# Altium schematic sheet BMS High-Side FET Driver.SchDoc
size A3
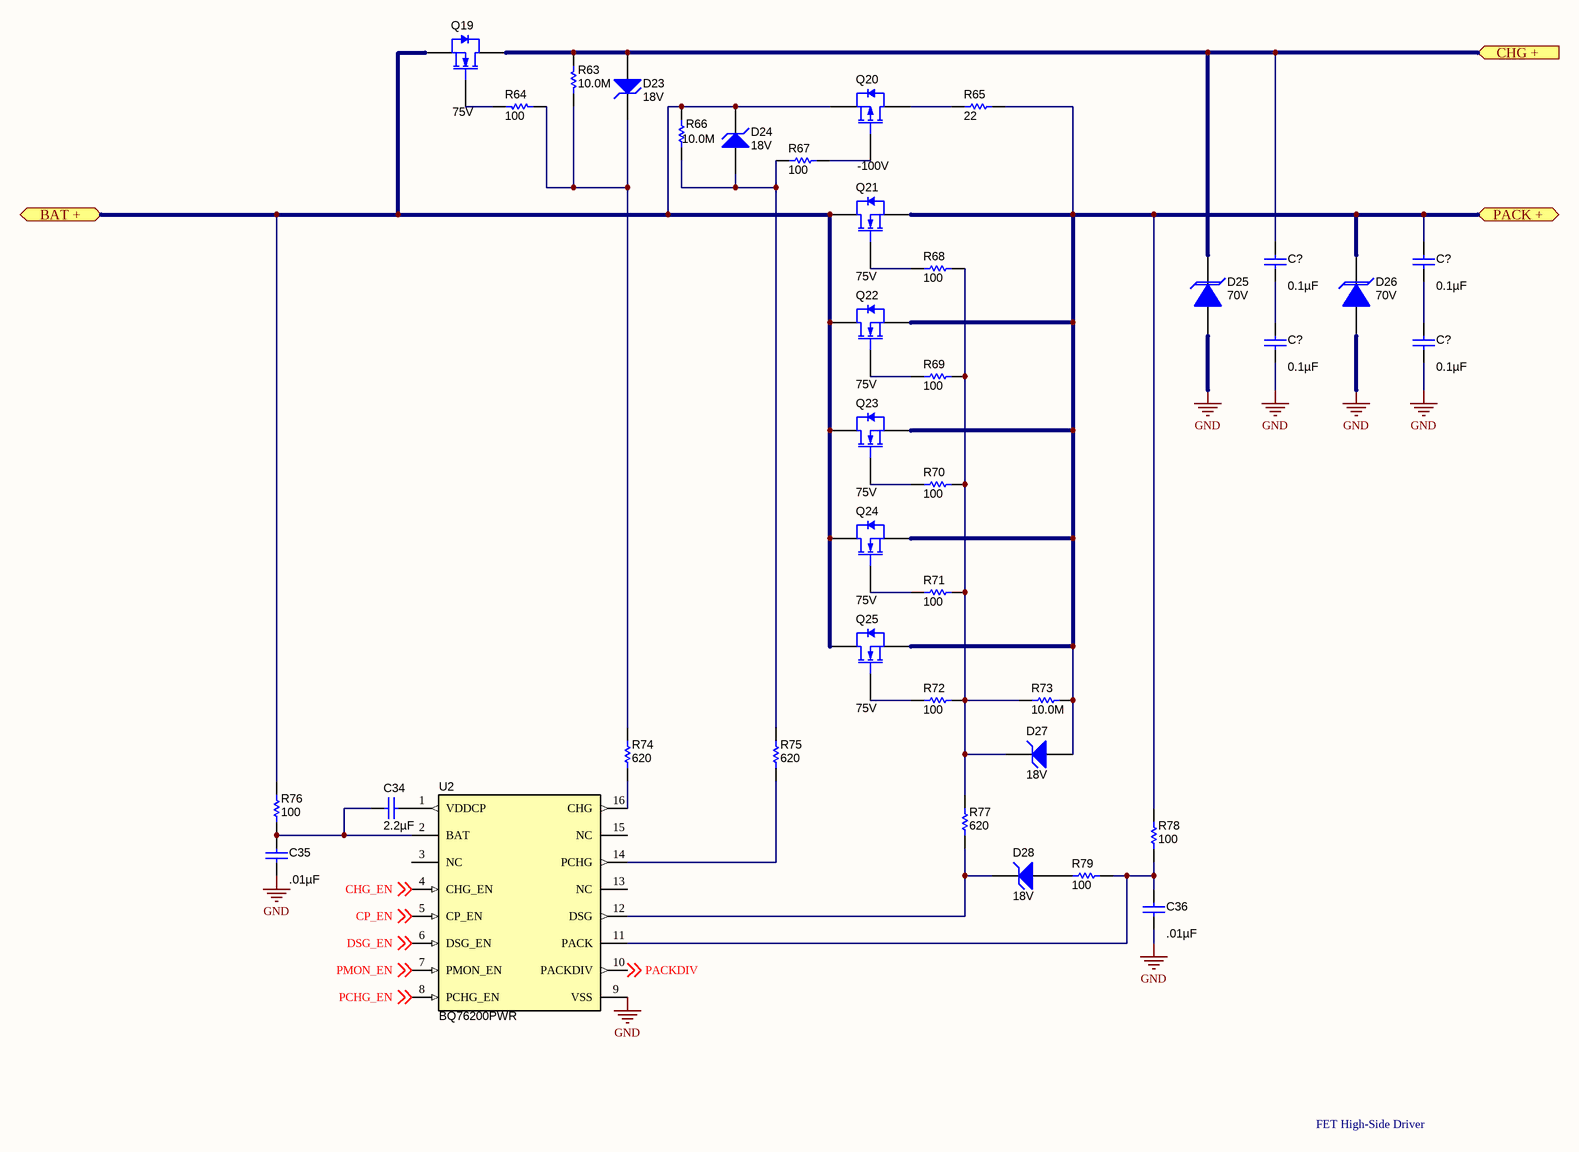
[diagram p0: BMS High-Side FET Driver.SchDoc]

## Parts
(Parts that share a designator on the sheet are numbered #1, #2 ... from top to bottom, then left to right.)
C34  ValueDisplayed: 2.2µF  [CAP 0805/2012]  (hidden comment: CGA4J1X7R1V225K125AE)
C35  ValueDisplayed: .01µF  [CAP 0805/2012]  (hidden comment: GCM188R72A103KA37D)
C36  ValueDisplayed: .01µF  [CAP 0805/2012]  (hidden comment: GCM188R72A103KA37D)
C?#1  ValueDisplayed: 0.1µF  [CAP 0603/1608]  (hidden comment: CL10B104KC8NNNC)
C?#2  ValueDisplayed: 0.1µF  [CAP 0603/1608]  (hidden comment: CL10B104KC8NNNC)
C?#3  ValueDisplayed: 0.1µF  [CAP 0603/1608]  (hidden comment: CL10B104KC8NNNC)
C?#4  ValueDisplayed: 0.1µF  [CAP 0603/1608]  (hidden comment: CL10B104KC8NNNC)
D23  value 18V  [SOD-123]  (hidden comment: BZT52C18-E3-08)
D24  value 18V  [SOD-123]  (hidden comment: BZT52C18-E3-08)
D25  value 70V  [DO214AC SMA]  (hidden comment: SMAT70A-13-F)
D26  value 70V  [DO214AC SMA]  (hidden comment: SMAT70A-13-F)
D27  value 18V  [SOD-123]  (hidden comment: BZT52C18-E3-08)
D28  value 18V  [SOD-123]  (hidden comment: BZT52C18-E3-08)
Q19  value 75V  [DIRECTFET L8]  (hidden comment: IRF7759L2)
Q20  value -100V  [D-PAK]  (hidden comment: IRFR5410TRPBF)
Q21  value 75V  [DIRECTFET L8]  (hidden comment: IRF7759L2)
Q22  value 75V  [DIRECTFET L8]  (hidden comment: IRF7759L2)
Q23  value 75V  [DIRECTFET L8]  (hidden comment: IRF7759L2)
Q24  value 75V  [DIRECTFET L8]  (hidden comment: IRF7759L2)
Q25  value 75V  [DIRECTFET L8]  (hidden comment: IRF7759L2)
R63  ValueDisplayed: 10.0M  [RES 0603/1608]  (hidden comment: RCS060310M0FKEA)
R64  value 100  [RES 0603/1608]  (hidden comment: ERJ-PA3J101V)
R65  ValueDisplayed: 22  [STACKPOLE CSR2512]  (hidden comment: 352222RJT)
R66  ValueDisplayed: 10.0M  [RES 0603/1608]  (hidden comment: RCS060310M0FKEA)
R67  value 100  [RES 0603/1608]  (hidden comment: ERJ-PA3J101V)
R68  value 100  [RES 0603/1608]  (hidden comment: ERJ-PA3J101V)
R69  value 100  [RES 0603/1608]  (hidden comment: ERJ-PA3J101V)
R70  value 100  [RES 0603/1608]  (hidden comment: ERJ-PA3J101V)
R71  value 100  [RES 0603/1608]  (hidden comment: ERJ-PA3J101V)
R72  value 100  [RES 0603/1608]  (hidden comment: ERJ-PA3J101V)
R73  ValueDisplayed: 10.0M  [RES 0603/1608]  (hidden comment: RCS060310M0FKEA)
R74  ValueDisplayed: 620  [RES 0603/1608]  (hidden comment: ERJ-3EKF6200V)
R75  ValueDisplayed: 620  [RES 0603/1608]  (hidden comment: ERJ-3EKF6200V)
R76  value 100  [RES 0603/1608]  (hidden comment: ERJ-PA3J101V)
R77  ValueDisplayed: 620  [RES 0603/1608]  (hidden comment: ERJ-3EKF6200V)
R78  value 100  [RES 0603/1608]  (hidden comment: ERJ-PA3J101V)
R79  value 100  [RES 0603/1608]  (hidden comment: ERJ-PA3J101V)
U2  BQ76200PWR  [TTSOP16_N V2]

## Ports
BAT + (bidir), CHG + (in), PACK + (bidir)

## Nets
GND: C35.2 C36.2 C?#3.2 C?#4.2 D25.2(A) D26.2(A) U2.9(VSS)
BAT +: D24.1(K) Q19.2(S) Q20.2(S) Q21.3(D) Q22.3(D) Q23.3(D) Q24.3(D) Q25.3(D) R66.1 R76.2 ; port BAT +
CHG +: C?#1.2 D23.2(A) D25.1(K) Q19.3(D) R63.2 ; port CHG +
CHG_EN: U2.4(CHG_EN) ; off-sheet CHG_EN
CP_EN: U2.5(CP_EN) ; off-sheet CP_EN
DSG_EN: U2.6(DSG_EN) ; off-sheet DSG_EN
PACK +: C?#2.1 D26.1(K) D27.2(A) Q21.2(S) Q22.2(S) Q23.2(S) Q24.2(S) Q25.2(S) R65.2 R73.1 R78.1 ; port PACK +
PACKDIV: U2.10(PACKDIV) ; off-sheet PACKDIV
PCHG_EN: U2.8(PCHG_EN) ; off-sheet PCHG_EN
PMON_EN: U2.7(PMON_EN) ; off-sheet PMON_EN
NetC34_1: C34.1 U2.1(VDDCP)
NetC34_2: C34.2 C35.1 R76.1 U2.2(BAT)
NetC36_1: C36.1 R78.2 R79.2 U2.11(PACK)
NetC?#1_1: C?#1.1 C?#3.1
NetC?#2_2: C?#2.2 C?#4.1
NetD23_1: D23.1(K) R63.1 R64.1 R74.2
NetD24_2: D24.2(A) R66.2 R67.1 R75.2
NetD27_1: D27.1(K) R68.2 R69.2 R70.2 R71.2 R72.1 R73.2 R77.2
NetD28_1: D28.1(K) R77.1 U2.12(DSG)
NetD28_2: D28.2(A) R79.1
NetQ19_1: Q19.1(G) R64.2
NetQ20_1: Q20.1(G) R67.2
NetQ20_3: Q20.3(D) R65.1
NetQ21_1: Q21.1(G) R68.1
NetQ22_1: Q22.1(G) R69.1
NetQ23_1: Q23.1(G) R70.1
NetQ24_1: Q24.1(G) R71.1
NetQ25_1: Q25.1(G) R72.2
NetR74_1: R74.1 U2.16(CHG)
NetR75_1: R75.1 U2.14(PCHG)

Not connected (* = marked no-connect by the designer): U2 3(NC) 13(NC) 15(NC)

## Notes on the sheet
- FET High-Side Driver

## Library data of the parts
C34 = CGA4J1X7R1V225K125AE: CAP CER 2.2µF 10% 35V X7R 0805; Manufacturer: TDK Corporation; Polarized: N; CompType: Capacitor; U/M: EA; Cap_F: 0.0000022; Tolerance_%: 10; Value1: Unknown; VDC_V: 16; TaMin_C: -55; TaMax_C: 125; Cap_Case: 0805; SizeArea_mm2: 2.5; SizeAreaWB_mm2: 4.68; SizeX_mm: 2.0; SizeY_mm: 1.25; AEC Category: Q200; SymbolVersion: 2008-07-09; Value: 2.2µF; PartNumber: CGA4J1X7R1V225K125AE; PackageReference: 0805; RoHS: Y; Value2: 35V; MountType: SMT; Technology: Ceramic; TempCo: X7R; SizeZ_mm: 1.25; Published: 2008-06-19; Publisher: Texas Instruments; LatestRevisionDate: 2016-06-14; ComponentLink1Description: Datasheet link; ComponentLink1URL: https://product.tdk.com/info/en/documents/chara_sheet/CGA4J1X7R1V225K125AE.pdf; AEC Qualified: N; AEC Grade: N/A; Supplier 1: Digi-Key; Supplier 2: Mouser; Supplier 3: Newark; Supplier Part Number 1: 445-8787-1-ND; Supplier Part Number 2: 810-CGA4J1X7R1V225KS; Supplier Part Number 3: 93T4804
C35 C36 = GCM188R72A103KA37D: CAP CER .01μF 10% 100V X7R 0603; Manufacturer: Murata Electronics North America; Polarized: N; CompType: Capacitor; U/M: EA; Cap_F: 0.00000001; Tolerance_%: 10; Value1: Unknown; VDC_V: 100; Value2: 35V; TaMin_C: -55; TaMax_C: 125; Cap_Case: 0603; SizeArea_mm2: 1.28; SizeAreaWB_mm2: 4.68; SizeX_mm: 1.6; SizeY_mm: 0.8; AEC Category: Q200; SymbolVersion: 2008-07-09; Value: .01µF; PartNumber: GCM188R72A103KA37D; PackageReference: 0603; RoHS: Y; MountType: SMT; Technology: Ceramic; TempCo: X7R; SizeZ_mm: 0.8; Published: 2008-06-19; Publisher: Texas Instruments; LatestRevisionDate: 2016-06-14; ComponentLink1Description: Datasheet link; ComponentLink1URL: https://product.tdk.com/info/en/documents/chara_sheet/CGA4J1X7R1V225K125AE.pdf; AEC Qualified: N; AEC Grade: N/A; Supplier 1: Mouser; Supplier 2: Digi-Key; Supplier Part Number 1: 81-GCM188R72A103KA7D; Supplier Part Number 2: 490-4781-6-ND
C?#1-C?#4 = CL10B104KC8NNNC: CAP CER 0.1UF 10% 100V X7R 0603; Manufacturer: Samsung Electro-Mechanics; Polarized: N; CompType: Capacitor; U/M: EA; Cap_F: 0.0000001; Tolerance_%: 10; VDC_V: 100; IRMS_A: 0.97199; TaMin_C: -55; TaMax_C: 125; Cap_Case: 0603; SizeArea_mm2: 1.28; SizeAreaWB_mm2: 4.68; SizeX_mm: 1.6; SizeY_mm: 0.8; SizeZ_mm: 1; SymbolVersion: 2008-07-09; Value: 0.1uF; PartNumber: CL10B104KC8NNNC; PackageReference: 0603; RoHS: Y; Value1: 100V; MountType: SMT; Technology: Ceramic; TempCo: X7R; Published: 2008-06-19; Publisher: Texas Instruments; LatestRevisionDate: 2016-06-14; ComponentLink1Description: Datasheet link; ComponentLink1URL: http://www.samsungsem.com/kr/support/product-search/mlcc/CL10B104KC8NNNC.jsp; AEC Category: N/A; AEC Qualified: N; AEC Grade: N/A; Supplier 1: Digi-Key; Supplier 2: Mouser; Supplier Part Number 1: 445-1314-6-ND; Supplier Part Number 2: 810-C1608X7R1H104K
D23 D24 D27 D28 = BZT52C18-E3-08: DIODE ZENER 18V 5% 410MW SOD123; Manufacturer: Vishay Semiconductor Diodes Division; SymbolCreator: a0412235; U/M: EA; Power_W: .41; Vz_V: 18; Value1: 0.41W; RJA_CperW: 150; AEC Category: Q101; SymbolVersion: 2010-08-25; PartNumber: BZT52C18-E3-08; PackageReference: SOD-123; CompType: Zener; Vr_V: N/A; MountType: SMT; RoHS: Y; ComponentLink1Description: Datasheet link; ComponentLink1URL: http://www.vishay.com/docs/85760/bzt52.pdf; Published: 2008-10-08; Publisher: Texas Instruments; LatestRevisionDate: 2016-01-12; LatestRevisionNote: Updated Supplier Data; AEC Qualified: ?; Supplier 1: Digi-Key; Supplier 2: Mouser; Supplier Part Number 1: BZT52C18-E3-08GIDKR-ND; Supplier Part Number 2: 78-BZT52C18-E3-08
D25 D26 = SMAT70A-13-F: TVS DIODE 70VWM 100VC SMA; Manufacturer: Diodes Inc.; U/M: EA; Vc_V: 100; Ipp_A: 3.5; Value1: 3.5A; Vbr_V: 77.8; Value2: 77.8V; TJmax_C: 150; Vso_V: 70; Ppp_W: 400; Value3: 100V; ComponentLink1URL: https://www.diodes.com/assets/Datasheets/ds30213.pdf; SymbolVersion: 2008-12-08; PackageReference: DO-214AC; PartNumber: SMAT70A-13-F; ComponentLink1Description: Datasheet link; CompType: Diode; MountType: SMT; RoHS: Y; Type: TVS; Published: 2008-06-26; Publisher: Texas Instruments; LatestRevisionDate: 2013-10-23; Supplier 1: Digi-Key; Supplier 2: Mouser; Supplier Part Number 1: SMAT70A-FDIDKR-ND; Supplier Part Number 2: 621-SMAT70A-13-F
Q19 Q21-Q25 = IRF7759L2: N-Channel 75V 26A (Ta), 375A (Tc) 3.3W (Ta), 125W (Tc) Surface Mount DIRECTFET L8; Manufacturer: Infineon Technologies; Alternate Manufacturer: None; CompType: MOSFET; U/M: EA; ChType: N; VdsMax_V: 75; Value1: .0018 ohm; Rdson_mOhm: 1.8; Value2: 200 nC; QgTyp_nC: 200; Vgs_V: 20; IdsMax_A: 260; SymbolVersion: 2009-09-19; PartNumber: IRF7759L2; PackageReference: L8; RoHS: Y; MountType: SMT; Published: 2009-09-19; Publisher: Infineon Technologies; LatestRevisionDate: 2009-09-19; LatestRevisionNote: Added parts.; ComponentLink1Description: Datasheet link; ComponentLink1URL: https://www.infineon.com/dgdl/irf7759l2pbf.pdf?fileId=5546d462533600a40153560478171cb0; Supplier 1: Digi-Key; Supplier Part Number 1: IRF7759L2TRPBFCT-ND; Supplier 2: Mouser; Supplier Part Number 2: 942-IRF7759L2TRPBF; Supplier 3: Farnell; Supplier Part Number 3: 91Y4755
Q20 = IRFR5410TRPBF: MOSFET P-CH 100V 13A DPAK; Manufacturer: Infineon Technologies; Alternate Manufacturer: None; U/M: EA; ChType: P; VdsMax_V: -100; Value1: .205 ohm; Rdson45_Ohm: .205; Value2: 58 nC; QgTyp_nC: 58; Vgs_V: -20; IdsMax_A: -13; SymbolVersion: 2008-07-09; PartNumber: IRFR5410TRPBF; PackageReference: TO-252-3; CompType: MOSFET; RoHS: Y; MountType: SMT; Published: 2008-06-19; Publisher: Texas Instruments; LatestRevisionDate: 2013-10-21; LatestRevisionNote: Added parts.; ComponentLink1Description: Datasheet link; ComponentLink1URL: https://www.infineon.com/dgdl/irfr5410pbf.pdf?fileId=5546d462533600a4015356356f622107; Supplier 1: Digi-Key; Supplier 2: Mouser; Supplier Part Number 1: IRFR5410PBFDKR-ND; Supplier Part Number 2: 942-IRFR5410TRPBF
R63 R66 R73 = RCS060310M0FKEA: RES SMD 10M OHM 1% 1/4W 0603; Manufacturer: Vishay-Dale; CompType: Resistor; Value: 10.0Meg; Res_ohm: 10000000; Value_Code: 10M0; Tolerance_%: 1; Power_W: 0.25; Value2: 0.25W; VDC_V: 75; TempCo: 100 ppm/C; EIA_Code: E96; U/M: EA; AEC Category: Q200; SymbolVersion: 2009-05-29; PartNumber: RCS060310M0FKEA; PackageReference: 0603; RoHS: Y; Value1: 1%; MountType: SMT; Technology: Thick Film; Published: 2008-06-26; Publisher: Texas Instruments; LatestRevisionDate: 2016-04-07; ComponentLink1Description: Datasheet link; ComponentLink1URL: http://www.vishay.com/docs/20065/rcse3.pdf; AEC Qualified: ?; Supplier 1: Digi-Key; Supplier 2: Mouser; Supplier Part Number 1: 541-2804-6-ND; Supplier Part Number 2: 71-RCS060310M0FKEA
R64 R67-R72 R76 R78 R79 = ERJ-PA3J101V: RES SMD 100 OHM 5% 1/4W 0603; Manufacturer: Panasonic Electronic Components; CompType: Resistor; Value_Code: 100R; Tolerance_%: 5; Power_W: 0.125; Value2: 0.125W; VDC_V: 150; TempCo: 200 ppm/C; EIA_Code: E96; U/M: EA; SymbolVersion: 2009-05-29; PartNumber: ERJ-PA3J101V; PackageReference: 0603; RoHS: Y; Res_ohm: 100; Value1: 5%; MountType: SMT; Technology: Thick Film; Published: 2008-06-26; Publisher: Texas Instruments; LatestRevisionDate: 2013-01-08; ComponentLink1Description: Datasheet link; ComponentLink1URL: https://media.digikey.com/pdf/Data%20Sheets/Panasonic%20Resistors%20Thermistors%20PDFs/ERJ-PA3_Series_NPI.pdf; Supplier 1: Digi-Key; Supplier Part Number 1: P100BZDKR-ND
R65 = 352222RJT: RES SMD 22 OHM 5% 3W 2512; Manufacturer: TE Connectivity Passive Product; CompType: Resistor; Value: 22; Tolerance_%: 5; VDC_V: 250; U/M: EA; SymbolVersion: 2009-05-29; PartNumber: 352222RJT; PackageReference: 2512; RoHS: Y; Res_ohm: 22; Value_Code: 22; Value1: 5%; Power_W: 3W; Value2: 3W; MountType: SMT; Technology: Thick Film; Published: 2008-06-26; Publisher: Texas Instruments; LatestRevisionDate: 2016-06-10; ComponentLink1Description: Datasheet link; ComponentLink1URL: http://www.te.com/commerce/DocumentDelivery/DDEController?Action=srchrtrv&DocNm=9-1773463-7&DocType=DS&DocLang=English; Supplier 1: Newark; Supplier 2: Mouser; Supplier 3: Digi-Key; Supplier Part Number 1: 48Y0381; Supplier Part Number 2: 279-352222RJT; Supplier Part Number 3: A121192CT-ND
R74 R75 R77 = ERJ-3EKF6200V: RES SMD 620 OHM 1% 1/10W 0603; Manufacturer: Panasonic Electronic Components; CompType: Resistor; Value: 620; Value_Code: 1k00; Tolerance_%: .1; Value2: .1W; VDC_V: 400; TempCo: 100 ppm/C; SizeArea_mm2: 1.28; SizeX_mm: 1.6; SizeY_mm: .8; SizeZ_mm: .55; EIA_Code: E24; U/M: EA; AEC Category: Q200; AEC Qualified: Y; AEC Grade: 0; SymbolVersion: 2009-05-29; PartNumber: ERJ-3EKF6200V; PackageReference: 0603; RoHS: Y; Res_ohm: 620; Value1: 1%; Power_W: .1; MountType: SMT; Technology: Thick Film; Published: 2008-06-26; Publisher: Texas Instruments; LatestRevisionDate: 2016-06-10; ComponentLink1Description: Datasheet link; ComponentLink1URL: https://industrial.panasonic.com/cdbs/www-data/pdf/RDA0000/AOA0000C304.pdf; Supplier 1: Mouser; Supplier 2: Digi-Key; Supplier Part Number 1: 667-ERJ-3EKF6200V; Supplier Part Number 2: P620HDKR-ND
U2 = BQ76200PWR: bq76200: Low-Power, High-Side N-channel FET Driver with Pack Voltage Monitor, PW0016A; Manufacturer: Texas Instruments; SymbolCreator: x0208325; SizeArea_mm2: 32; SizeAreaWB_mm2: 58.8; SizeX_mm: 6.4; SizeY_mm: 5; SizeZ_mm: 1.2; CompType: IC; U/M: EA; SymbolVersion: 2013-12-26; PartNumber: BQ76200PWR; Alternate PartNumber: BQ76200PW; PackageReference: PW0016A; PackageDescription: TSSOP-16; MountType: SMT; ComponentLink1Description: Datasheet Link; ComponentLink1URL: http://www.ti.com/lit/ds/symlink/bq76200.pdf; RoHS: Y; Publisher: Texas Instruments; LatestRevisionDate: 2016-06-17; Alternate Manufacturer: Texas Instruments